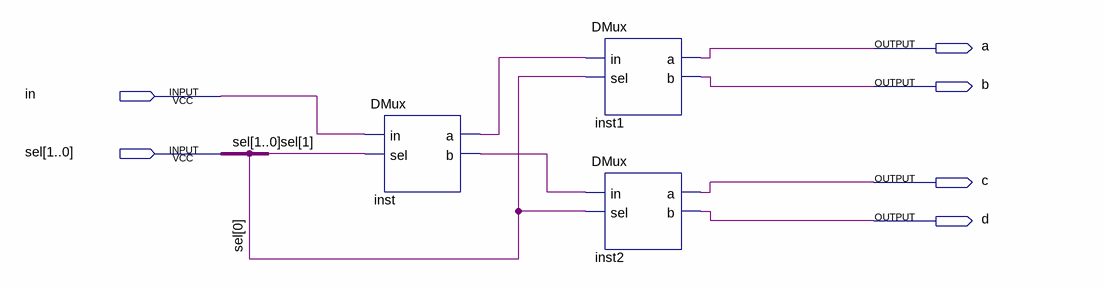
[diagram p0: schematic sheet]
// Quartus schematic DMux4Way.bdf as structural Verilog: 3 symbols, 6 pins
module DMux4Way (
  input  in,
  input  [1:0] sel,
  output a,
  output b,
  output c,
  output d
);

  wire inst_a, inst_b;

  DMux inst (.in(in), .sel(sel[1]), .a(inst_a), .b(inst_b));
  DMux inst1 (.in(inst_a), .sel(sel[0]), .a(a), .b(b));
  DMux inst2 (.in(inst_b), .sel(sel[0]), .a(c), .b(d));
endmodule
